# EAGLE schematic C3 (EAGLE 7.5.0)

## Sheet 1 of 2: Schematic1/2
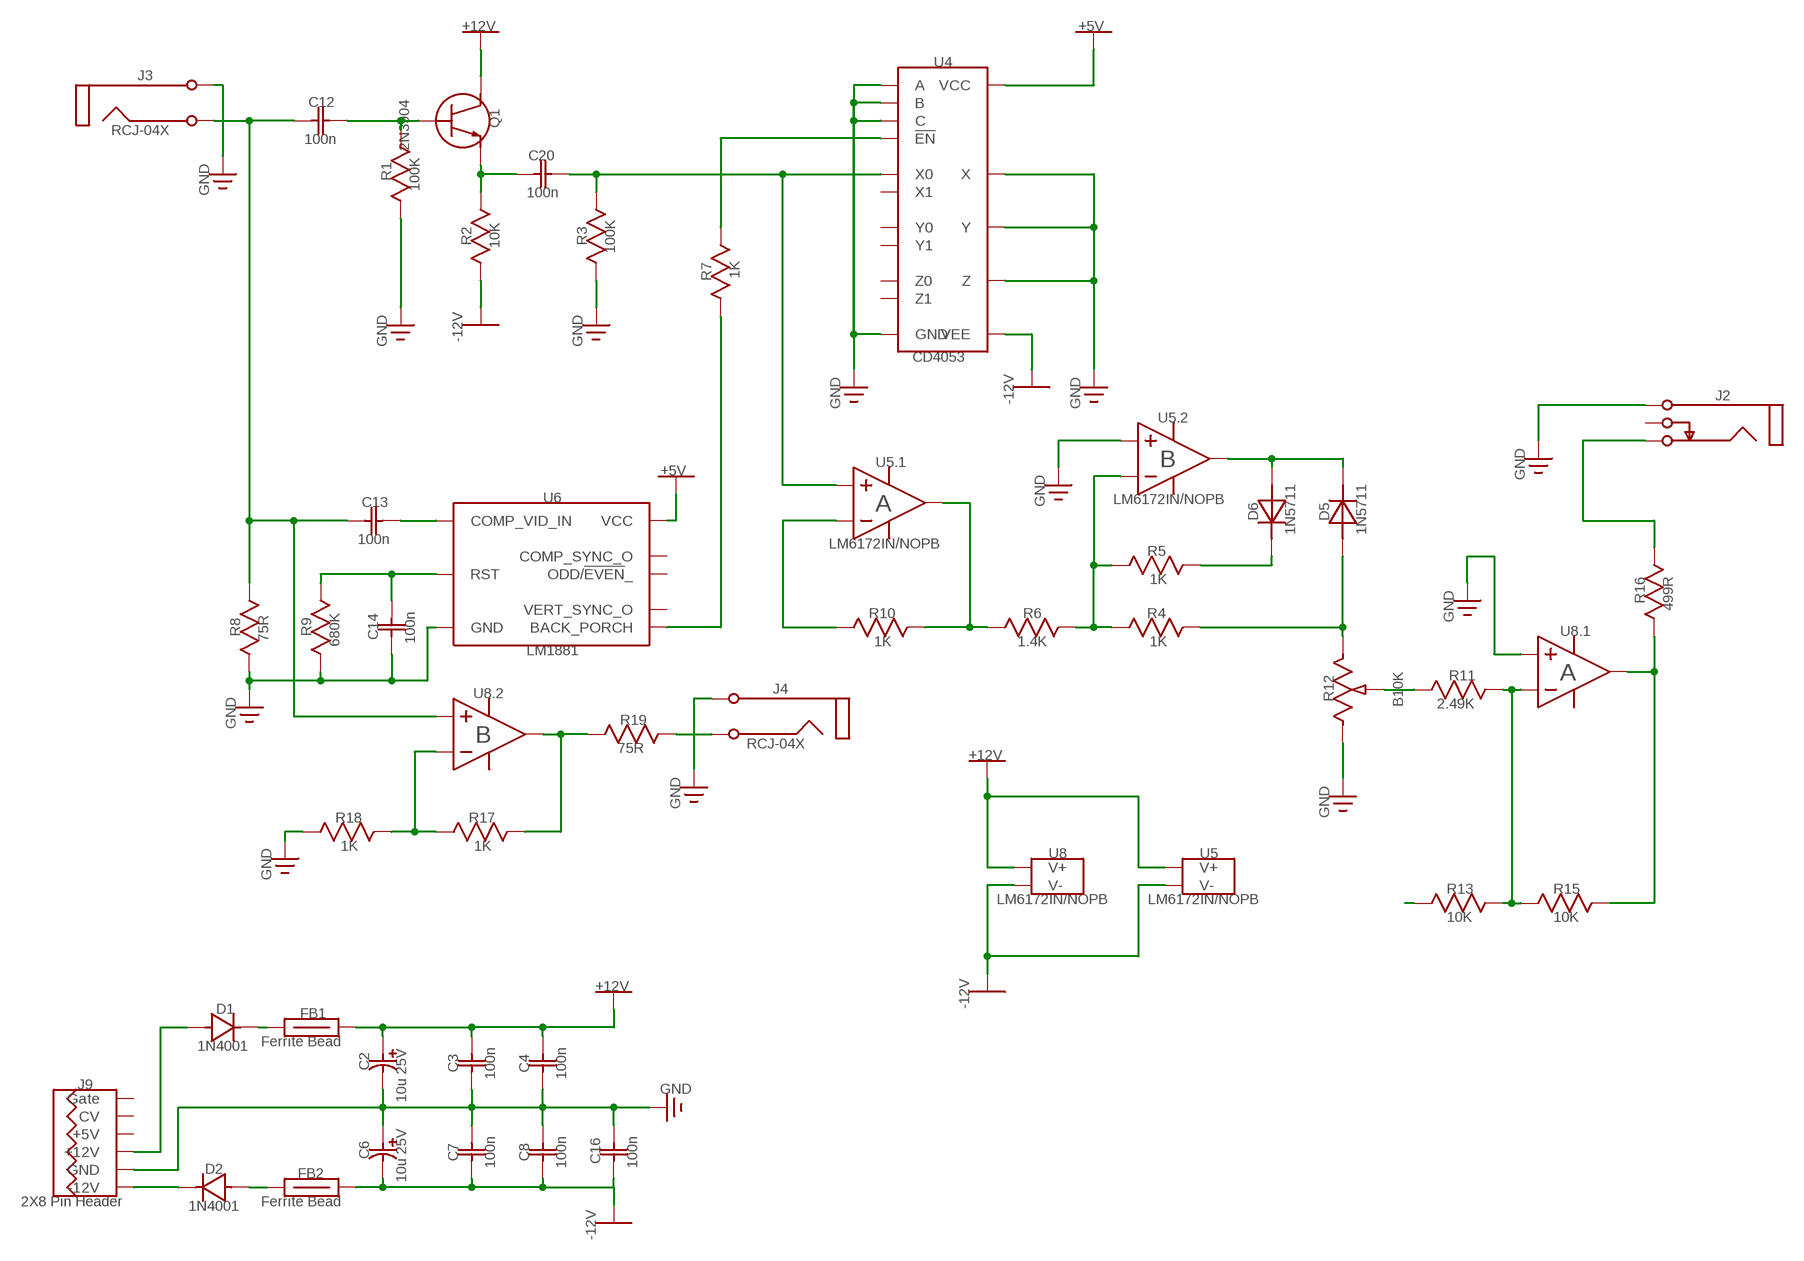
[diagram p0: schematic, sheet 1]

### Parts
C2  10u 25V  EC80-5  [CAPPR-2/5.08]
C3  100n  CAP100  [CAP-2.54/6.6X3]
C4  100n  CAP100  [CAP-2.54/6.6X3]
C6  10u 25V  EC80-5  [CAPPR-2/5.08]
C7  100n  CAP100  [CAP-2.54/6.6X3]
C8  100n  CAP100  [CAP-2.54/6.6X3]
C12  100n  CAP100  [CAP-2.54/6.6X3]
C13  100n  CAP100  [CAP-2.54/6.6X3]
C14  100n  CAP100  [CAP-2.54/6.6X3]
C16  100n  CAP100  [CAP-2.54/6.6X3]
C20  100n  CAP100  [CAP-2.54/6.6X3]
D1  1N4001  [DO-41]
D2  1N4001  [DO-41]
D5  1N5711  [DO-35]
D6  1N5711  [DO-35]
FB1  68R  FERRITE_BEAD  [FB-10.16/4.45X3.5]
FB2  68R  FERRITE_BEAD  [FB-10.16/4.45X3.5]
J2  PJ302M  [PJ302M]
J3  RCJ-04X  [RCJ-04X]
J4  RCJ-04X_23  [RCJ-04X]
J9  2X8_PIN_HEADER  [IDC16M]
Q1  2N3904  [TO-92]
R1  100K  RES300  [RES-7.62/5.1X2.5]
R2  10K  RES300  [RES-7.62/5.1X2.5]
R3  100K  RES300  [RES-7.62/5.1X2.5]
R4  1K  RES300  [RES-7.62/5.1X2.5]
R5  1K  RES300  [RES-7.62/5.1X2.5]
R6  1.4K  RES300  [RES-7.62/5.1X2.5]
R7  1K  RES300  [RES-7.62/5.1X2.5]
R8  75R  RES300  [RES-7.62/5.1X2.5]
R9  680K  RES300  [RES-7.62/5.1X2.5]
R10  1K  RES300  [RES-7.62/5.1X2.5]
R11  2.49K  RES300  [RES-7.62/5.1X2.5]
R12  B10K  ALPHA9H  [ALPHA9H]
R13  10K  RES300  [RES-7.62/5.1X2.5]
R15  10K  RES300  [RES-7.62/5.1X2.5]
R16  499R  RES300  [RES-7.62/5.1X2.5]
R17  1K  RES300  [RES-7.62/5.1X2.5]
R18  1K  RES300  [RES-7.62/5.1X2.5]
R19  75R  RES300  [RES-7.62/5.1X2.5]
U4  CD4053  [DIP-16]
U5  LM6172IN/NOPB  [DIP-8_16]
U6  LM1881  [DIP-8]
U8  LM6172IN/NOPB  [DIP-8_16]

### Nets
0V: C2.2(MINUS) C3.2 C4.2 C6.1(PLUS) C7.1 C8.1 C14.1 C16.1 J2.1A(Sleeve) J2.1B(Sleeve) J3.1(Sleeve) J4.1(Sleeve) J9.3(GND) J9.4(GND) J9.5(GND) R1.2(B) R3.2(B) R8.1(A) R9.1(A) R12.1(CCW) R18.1(A) U4.4(Z) U4.8(GND) U4.9(C) U4.10(B) U4.11(A) U4.14(X) U4.15(Y) U5.5(PART_2:IN+) U6.4(GND) U8.3(PART_1:IN+) ; supply symbol labelled GND ; also sheet 2
+5V: U4.16(VCC) U6.8(VCC) ; also sheet 2
+12V: C2.1(PLUS) C3.1 C4.1 FB1.2 Q1.3(C) U5.8(VCC_AND_GND:V+) U8.8(VCC_AND_GND:V+) ; also sheet 2
-12V: C6.2(MINUS) C7.2 C8.2 C16.2 FB2.2 R2.2(B) U4.7(VEE) U5.4(VCC_AND_GND:V-) U8.4(VCC_AND_GND:V-) ; also sheet 2
BIAS_POT_OUT: R13.1(A) ; also sheet 2
Net_0: C20.2 Q1.1(E) R2.1(A)
Net_1: D2.2(A) FB2.1
Net_2: D1.1(K) FB1.1
Net_3: C20.1 R3.1(A) U4.12(X0) U5.3(PART_1:IN+)
Net_4: C13.2 U6.2(COMP_VID_IN)
Net_5: D2.1(K) J9.1(-12V) J9.2(-12V)
Net_6: R7.1(A) U4.6(!EN)
Net_7: R10.1(A) U5.2(PART_1:IN-)
Net_8: J2.3A(Tip) J2.3B(Tip) R16.2(B)
Net_9: R17.2(B) R19.1(A) U8.7(PART_2:OUT)
Net_10: R4.1(A) R5.1(A) R6.2(B) U5.6(PART_2:IN-)
Net_11: D5.2(A) R4.2(B) R12.3(CW)
Net_12: D6.1(K) R5.2(B)
Net_20: C12.1 Q1.2(B) R1.1(A)
Net_22: D5.1(K) D6.2(A) U5.7(PART_2:OUT)
Net_33: D1.2(A) J9.9(+12V) J9.10(+12V)
Net_34: C12.2 C13.1 J3.2(Tip) R8.2(B) U8.5(PART_2:IN+)
Net_35: C14.2 R9.2(B) U6.6(RST)
Net_36: R7.2(B) U6.5(BACK_PORCH)
Net_37: R6.1(A) R10.2(B) U5.1(PART_1:OUT)
Net_38: R11.1(A) R12.2(W)
Net_39: R11.2(B) R13.2(B) R15.1(A) U8.2(PART_1:IN-)
Net_40: R15.2(B) R16.1(A) U8.1(PART_1:OUT)
Net_42: R17.1(A) R18.2(B) U8.6(PART_2:IN-)
Net_43: J4.2(Tip) R19.2(B)
Unconnected: J2.2A(Switch) J2.2B(Switch) J9.11(+5V) J9.12(+5V) J9.13(CV) J9.14(CV) J9.15(Gate) J9.16(Gate) U4.1(Y1) U4.2(Y0) U4.3(Z1) U4.5(Z0) U4.13(X1) U6.1(COMP_SYNC_O) U6.3(VERT_SYNC_O) U6.7(ODD/!EVEN!_)

### Notes on the sheet
- +12V | +5V
- U4
- J3
- C12
- RCJ-04X | Q1
- 100n
- 2N3904
- C20
- R1
- 100K | 100n
- GND
- R2 | 10K | R3
- 100K
- R7 | 1K
- -12V
- GND | GND
- CD4053
- -12V | J2
- GND | GND
- U5.2
- B
- U5.1
- +5V | GND
- A | LM6172IN/NOPB
- U6 | GND
- C13
- D6 | D5
- 100n | 1N5711 | 1N5711
- LM6172IN/NOPB
- R5
- 1K
- R16
- 499R
- R10 | R6 | R4 | GND
- R8 | R9 | C14 | 1K | 1.4K | 1K | U8.1
- 75R | 100n | LM1881
- 680K
- A
- R11
- J4
- U8.2 | R12 | 2.49K
- B10K
- GND | B | R19
- RCJ-04X
- 75R
- +12V
- GND
- GND
- R18 | R17
- 1K | 1K
- U8 | U5
- GND
- LM6172IN/NOPB | LM6172IN/NOPB | R13 | R15
- 10K | 10K
- +12V
- -12V
- D1
- FB1
- Ferrite Bead
- 1N4001
- C2 | C3 | C4
- 100n | 100n
- J9
- GND
- 10u 25V
- C6 | C7 | C8
- C16
- 100n | 100n | 100n
- D2
- FB2 | 10u 25V
- 2X8 Pin Header | Ferrite Bead
- 1N4001
- -12V

## Sheet 2 of 2: Schematic2/2
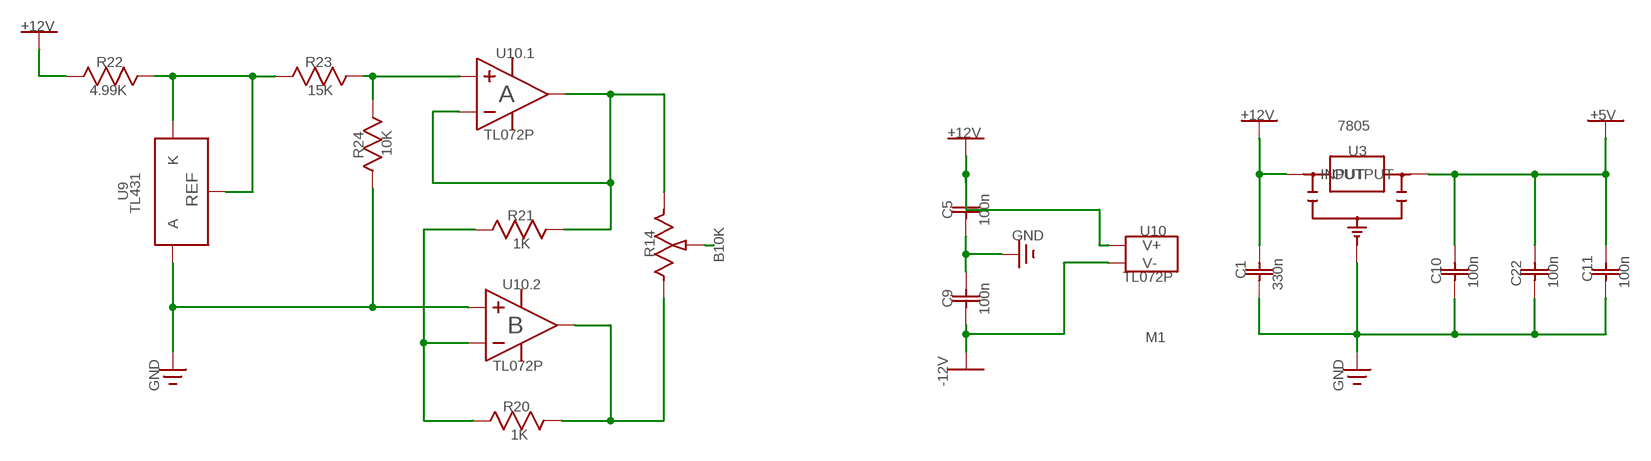
[diagram p1: schematic, sheet 2]

### Parts
C1  330n  CAP100  [CAP-2.54/6.6X3]
C5  100n  CAP100  [CAP-2.54/6.6X3]
C9  100n  CAP100  [CAP-2.54/6.6X3]
C10  100n  CAP100  [CAP-2.54/6.6X3]
C11  100n  CAP100  [CAP-2.54/6.6X3]
C22  100n  CAP100  [CAP-2.54/6.6X3]
M1  KEYSTONE621  [KEYSTONE621]
R14  B10K  ALPHA9H_14  [ALPHA9H]
R20  1K  RES300  [RES-7.62/5.1X2.5]
R21  1K  RES300  [RES-7.62/5.1X2.5]
R22  4.99K  RES300  [RES-7.62/5.1X2.5]
R23  15K  RES300  [RES-7.62/5.1X2.5]
R24  10K  RES300  [RES-7.62/5.1X2.5]
U3  7805  [TO-220H]
U9  TL431  [TO-92-100R]
U10  TL072P  [DIP-8_16]

### Nets
0V: C1.2 C5.2 C9.1 C10.2 C11.2 C22.2 R24.2(B) U3.2(GND) U9.2(A) U10.5(PART_2:IN+) ; supply symbol labelled GND ; also sheet 1
+5V: C10.1 C11.1 C22.1 U3.3(OUTPUT) ; also sheet 1
+12V: C1.1 C5.1 R22.2(B) U3.1(INPUT) U10.8(VCC_AND_GND:V+) ; also sheet 1
-12V: C9.2 U10.4(VCC_AND_GND:V-) ; also sheet 1
BIAS_POT_OUT: R14.2(W) ; also sheet 1
Net_13: R20.1(A) R21.1(A) U10.6(PART_2:IN-)
Net_17: R14.1(CCW) R21.2(B) U10.1(PART_1:OUT) U10.2(PART_1:IN-)
Net_18: R22.1(A) R23.2(B) U9.1(K) U9.3(REF)
Net_19: R14.3(CW) R20.2(B) U10.7(PART_2:OUT)
Net_30: R23.1(A) R24.1(A) U10.3(PART_1:IN+)

### Notes on the sheet
- +12V
- U10.1
- R22 | R23
- 4.99K | 15K | A
- +12V | 7805 | +5V
- TL072P
- +12V
- R24 | 10K | U3
- U9
- REF
- TL431
- R21 | C5
- 100n
- 1K | U10
- GND
- R14
- B10K
- TL072P
- C1 | C11
- C10 | C22
- U10.2 | 330n | 100n | 100n | 100n
- C9
- B | 100n
- M1
- TL072P
- -12V
- GND | GND
- R20
- 1K

## Library data of the parts
C1 = common:CAP100
C2 C6 = common:EC80-5
C3-C5 C7-C14 C16 C20 C22 = common:CAP100; VALUE: 330n
D1 D2 = common:1N4001
D5 D6 = common:1N5711; DATASHEET: http://datasheets.diptrace.com\fairchild\1N4148.pdf; MANUFACTURER: Fairchild
FB1 FB2 = common:FERRITE_BEAD; MANUFACTURER: Fair-Rite
J2 = common:PJ302M; DATASHEET: http://www.thonk.co.uk/shop/pj302m/
J3 = common:RCJ-04X
J4 = common:RCJ-04X_23
J9 = common:2X8_PIN_HEADER
M1 = common:KEYSTONE621
Q1 = common:2N3904; DATASHEET: http://datasheets.diptrace.com\fairchild\2N3904.pdf; MANUFACTURER: Fairchild
R1 R3 = common:RES300
R2 R4-R11 R13 R15-R24 = common:RES300; VALUE: 100K
R12 = common:ALPHA9H; DATASHEET: http://www.thonk.co.uk/shop/alpha-9mm-pots/; MANUFACTURER: Alpha
R14 = common:ALPHA9H_14; DATASHEET: http://www.thonk.co.uk/shop/alpha-9mm-pots/; MANUFACTURER: Alpha
U3 = common:7805; MANUFACTURER: Atmel
U4 = common:CD4053; DATASHEET: http://datasheets.diptrace.com\fairchild\CD4051BC.pdf; MANUFACTURER: Fairchild
U5 U8 = common:LM6172IN/NOPB; DATASHEET: http://www.ti.com/lit/gpn/lm6172; MANUFACTURER: Texas Instruments
U6 = common:LM1881; MANUFACTURER: National Semiconductor
U9 = common:TL431; DATASHEET: http://datasheets.diptrace.com\st_micro\CD00000986.pdf; MANUFACTURER: ST Microelectronics
U10 = common:TL072P; DATASHEET: http://datasheets.diptrace.com\ti\TL07x.pdf; MANUFACTURER: Texas Instruments